# EAGLE design Display (EAGLE 4.14)
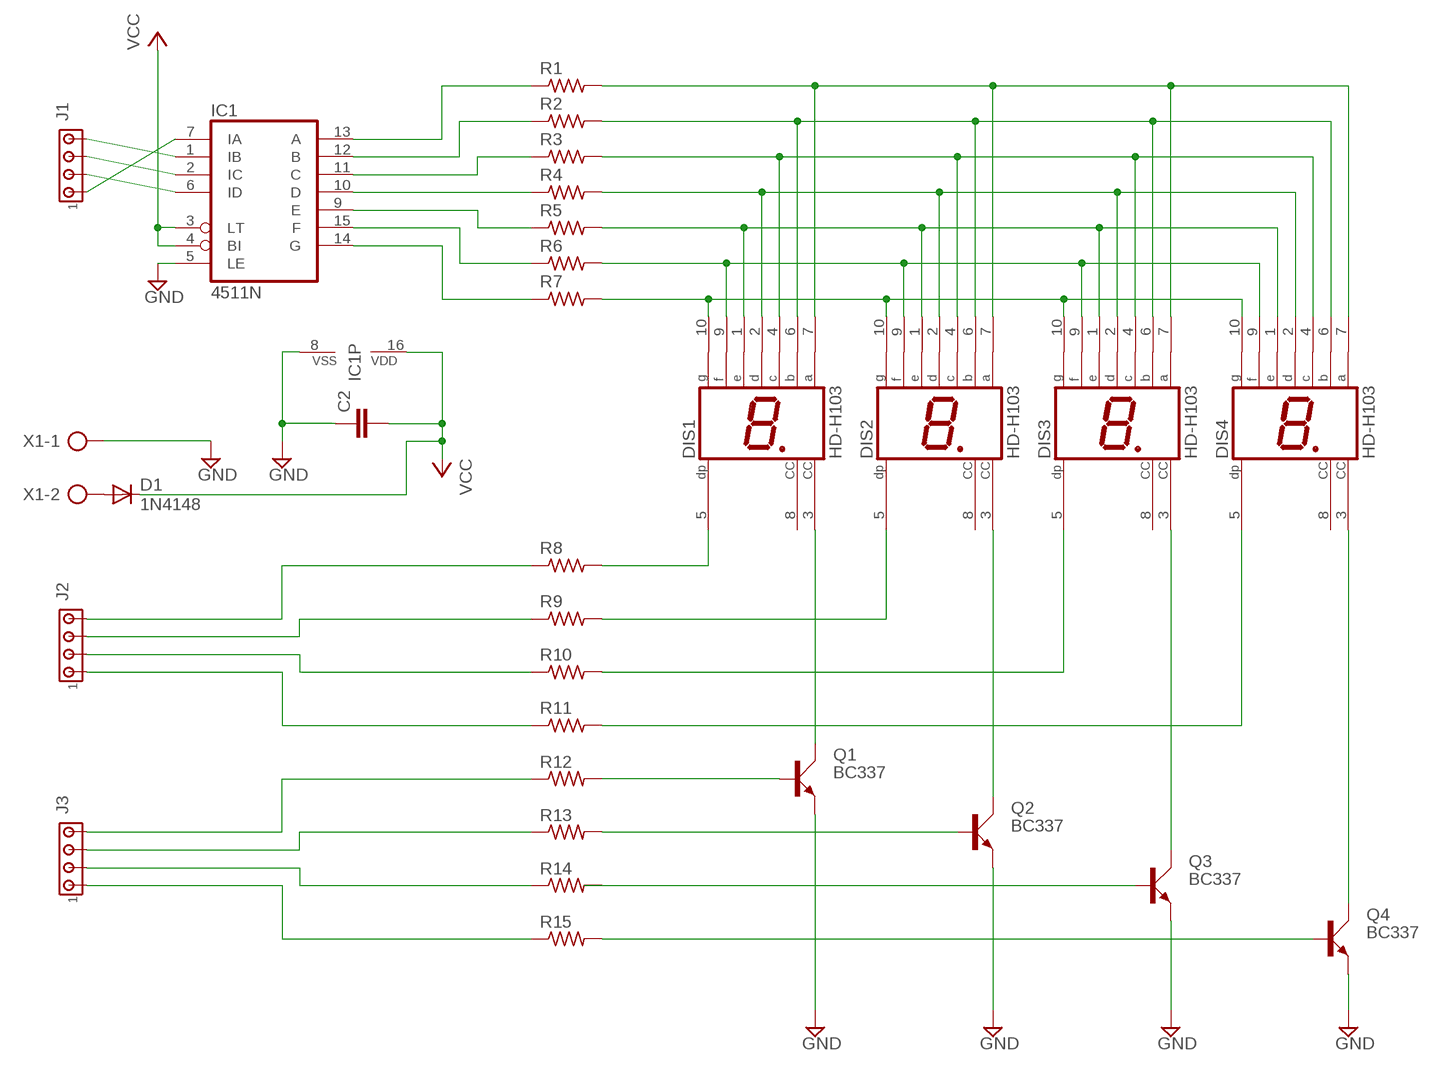
[diagram p0: schematic, sheet 1]

## Parts
C2  C5/3  [C5B3]
D1  1N4148  [DO35-10]
DIS1  HD-H103  [HDSP-M]
DIS2  HD-H103  [HDSP-M]
DIS3  HD-H103  [HDSP-M]
DIS4  HD-H103  [HDSP-M]
IC1  4511N  [DIL16]
J1  MTA04-100  [10X04MTA]
J2  MTA04-100  [10X04MTA]
J3  MTA04-100  [10X04MTA]
Q1  BC337  [SOT54A]
Q2  BC337  [SOT54A]
Q3  BC337  [SOT54A]
Q4  BC337  [SOT54A]
R1  R_0603  [R0603]
R2  R_0603  [R0603]
R3  R_0603  [R0603]
R4  R_0603  [R0603]
R5  R_0603  [R0603]
R6  R_0603  [R0603]
R7  R_0603  [R0603]
R8  R_0603  [R0603]
R9  R_0603  [R0603]
R10  R_0603  [R0603]
R11  R_0603  [R0603]
R12  R-US_0207/12  [0207/12]
R13  R-US_0207/12  [0207/12]
R14  R-US_0207/12  [0207/12]
R15  R-US_0207/12  [0207/12]
X1  AK500/2  [AK500/2]

## Nets
GND: C2.1 IC1.5(LE) IC1.8(VSS) Q1.E Q2.E Q3.E Q4.E X1.1
N$1: DIS1.10(G) DIS2.10(G) DIS3.10(G) DIS4.10(G) R7.2
N$2: DIS1.9(F) DIS2.9(F) DIS3.9(F) DIS4.9(F) R6.2
N$3: DIS1.1(E) DIS2.1(E) DIS3.1(E) DIS4.1(E) R5.2
N$4: DIS1.2(D) DIS2.2(D) DIS3.2(D) DIS4.2(D) R4.2
N$5: DIS1.4(C) DIS2.4(C) DIS3.4(C) DIS4.4(C) R3.2
N$6: DIS1.6(B) DIS2.6(B) DIS3.6(B) DIS4.6(B) R2.2
N$7: DIS1.7(A) DIS2.7(A) DIS3.7(A) DIS4.7(A) R1.2
N$8: IC1.13(A) R1.1
N$9: IC1.14(G) R7.1
N$10: IC1.15(F) R6.1
N$11: IC1.12(B) R2.1
N$12: IC1.11(C) R3.1
N$13: IC1.9(E) R5.1
N$14: IC1.10(D) R4.1
N$15: DIS1.5(DP) R8.2
N$16: DIS2.5(DP) R9.2
N$17: DIS3.5(DP) R10.2
N$18: DIS4.5(DP) R11.2
N$19: DIS1.3(CC) Q1.C
N$20: DIS2.3(CC) Q2.C
N$21: DIS3.3(CC) Q3.C
N$22: DIS4.3(CC) Q4.C
N$23: Q1.B R12.2
N$24: Q2.B R13.2
N$25: Q3.B R14.2
N$26: Q4.B R15.2
N$27: J2.1 R11.1
N$28: J2.4 R8.1
N$29: J2.3 R9.1
N$30: J2.2 R10.1
N$31: J3.4 R12.1
N$32: J3.3 R13.1
N$33: J3.1 R15.1
N$34: J3.2 R14.1
N$35: IC1.1(IB) J1.4
N$36: IC1.2(IC) J1.3
N$37: IC1.6(ID) J1.2
N$38: IC1.7(IA) J1.1
N$39: D1.A X1.2
VCC: C2.2 D1.C IC1.3(LT) IC1.4(BI) IC1.16(VDD)
Unconnected: DIS1.8(CC) DIS2.8(CC) DIS3.8(CC) DIS4.8(CC)

## Library data of the parts
C2 = capacitor-wima:C: CAPACITOR naming: grid - package width
D1 = diode:1N4148: DIODE high speed (Philips)
DIS1-DIS4 = display-hp:HD-H103: LED DISPLAY 1-character 7 segment, decimal point right
IC1 = 45xx:4511: BCD to 7-segment LATCH/DECODER/DRIVER
J1-J3 = con-amp:MTA04-100: AMP connector
Q1-Q4 = transistor-small-signal:BC337: NPN TRANSISTOR
R1-R11 = rc-master:R_: RESISTOR
R12-R15 = rcl:R-US_: RESISTOR, American symbol
X1 = con-ptr500:AK500/2: CONNECTOR

## Board
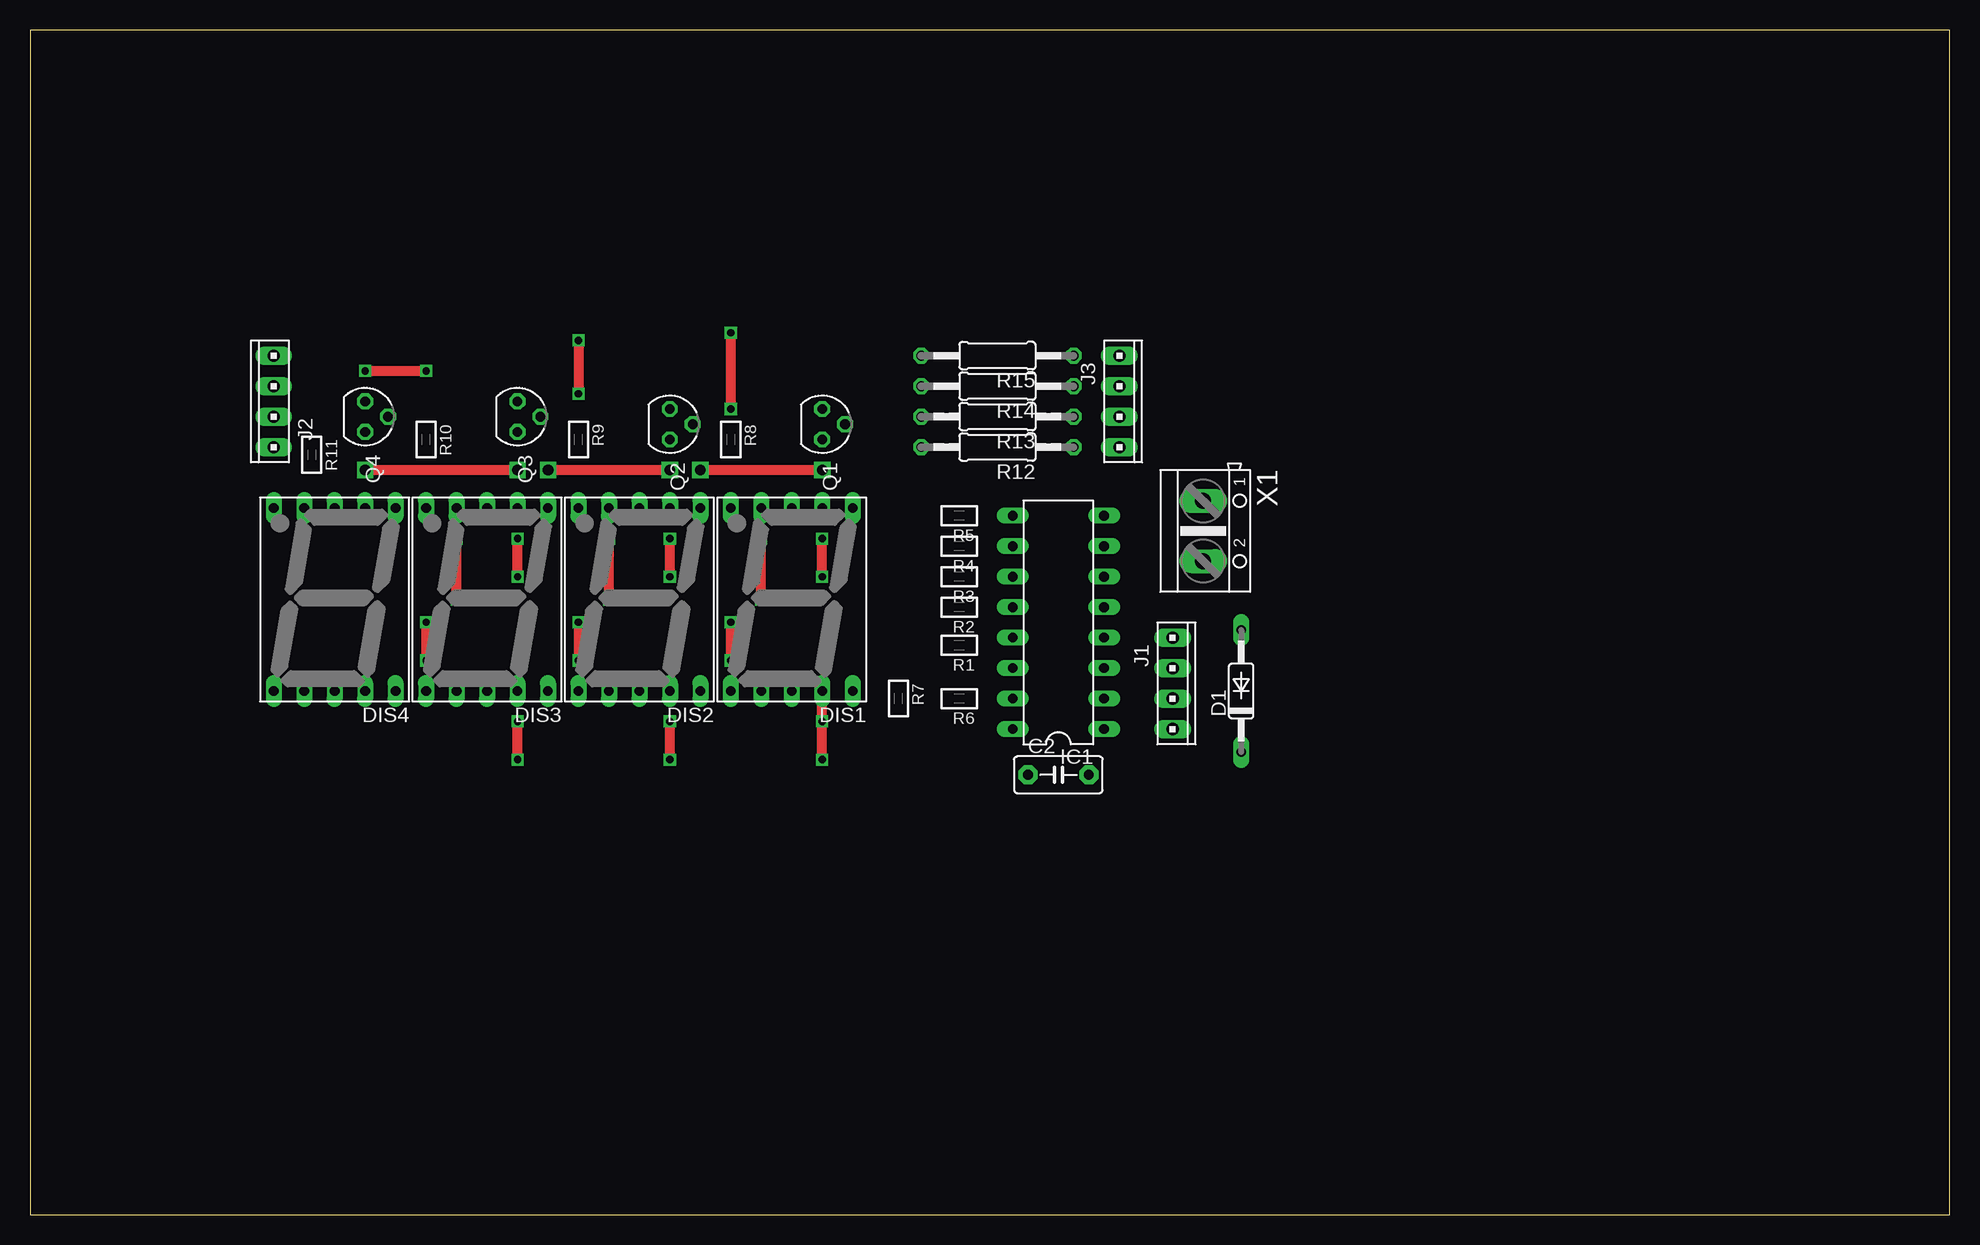
[diagram p1: board, top side]
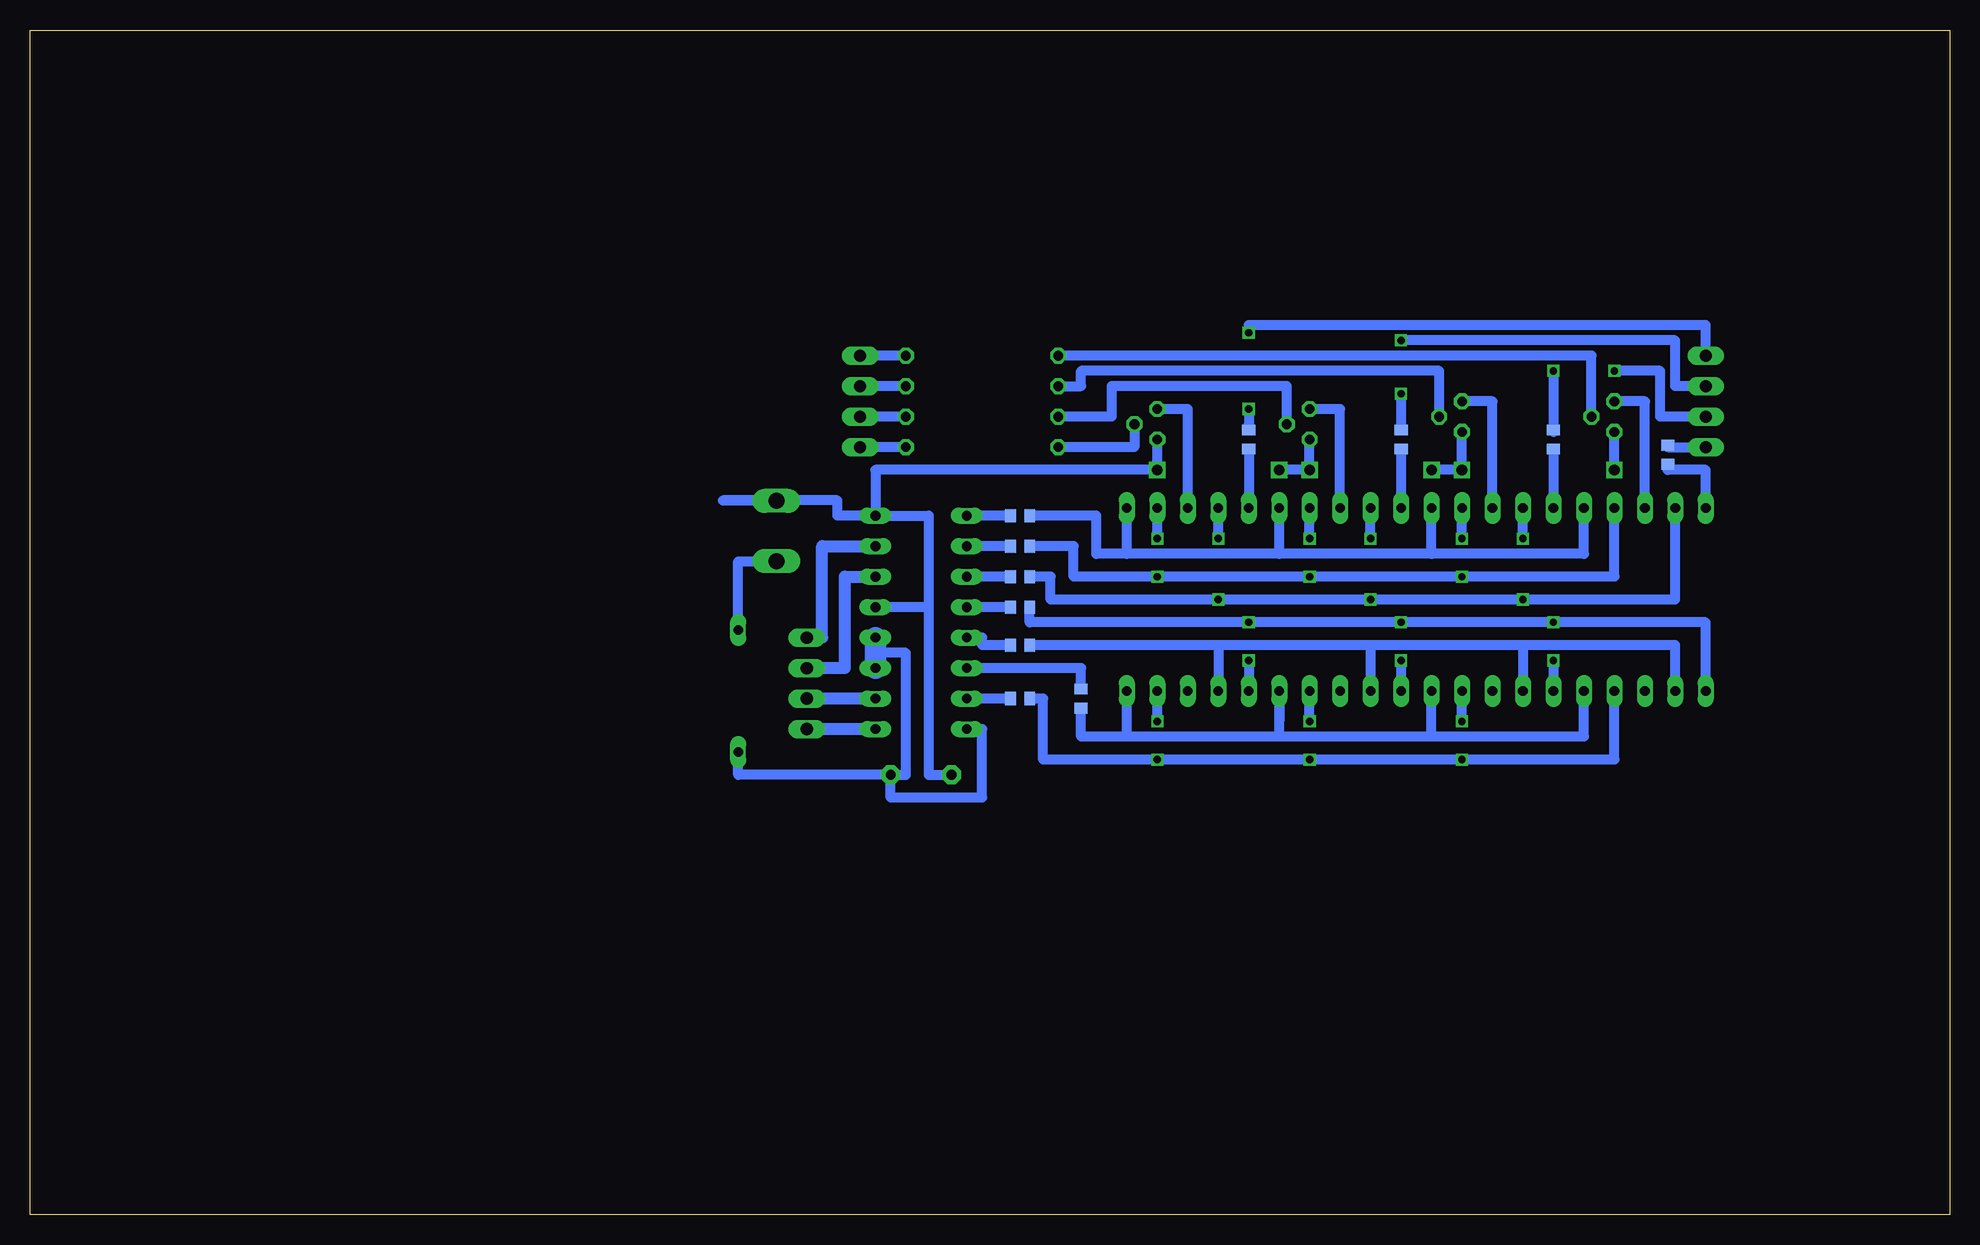
[diagram p2: board, bottom side, seen from below]

Size 160 x 98.73 mm. Coordinates in mm from the lower left corner, seen from the top.
Outline: 0,0 160,0 160,98.73 0,98.73 0,0
Copper layers (1*16): Top 0.035mm / dielectric 1.5mm / Bottom 0.035mm
Design rules "default": minimum track width 10mil, minimum drill 24mil, track to track 8mil, track to pad 8mil, pad to pad 8mil, via to via 8mil, smd to smd 8mil, copper to edge 40mil, drill to drill 8mil, minimum pad ring 10mil, minimum via ring 8mil, stop-mask expansion 4mil, vias tented up to drill 0mil, thermal gap 10mil

### Footprints (pad centres in the part's own frame; a part is rotated, then mirrored left to right if it is on the bottom)
C5B3 = drill 0.813 pad 1.6 octagon: 1 -2.54,0; 2 2.54,0
DO35-10 = drill 0.813 long: A 5.08,0; C -5.08,0
HDSP-M = drill 0.813 long: 1 -5.08,-7.62; 2 -2.54,-7.62; 3 0,-7.62; 4 2.54,-7.62; 5 5.08,-7.62; 6 5.08,7.62; 7 2.54,7.62; 8 0,7.62; 9 -2.54,7.62; 10 -5.08,7.62
DIL16 = drill 0.813 long: 1 -8.89,-3.81; 2 -6.35,-3.81; 3 -3.81,-3.81; 4 -1.27,-3.81; 5 1.27,-3.81; 6 3.81,-3.81; 7 6.35,-3.81; 8 8.89,-3.81; 9 8.89,3.81; 10 6.35,3.81; 11 3.81,3.81; 12 1.27,3.81; 13 -1.27,3.81; 14 -3.81,3.81; 15 -6.35,3.81; 16 -8.89,3.81
10X04MTA = drill 1.016 long: 1 -3.81,0; 2 -1.27,0; 3 1.27,0; 4 3.81,0
SOT54A = drill 0.813 octagon: B 0,1.905; C -1.27,0; E 1.27,0
R0603 = smd 0.9 x 1.1 bottom: 1 -0.794,0; 2 0.794,0
0207/12 = drill 0.813 octagon: 1 -6.35,0; 2 6.35,0
AK500/2 = drill 1.321 long: 1 -2.515,0; 2 2.515,0

### Placement (x,y rotation side)
C2  85.72,36.67 0 top
D1  100.96,43.65 90 top
DIS1  63.5,51.27 180 top
DIS2  50.8,51.27 180 top
DIS3  38.1,51.27 180 top
DIS4  25.39,51.27 180 top
IC1  85.72,49.37 90 top
J1  95.24,44.29 270 top
J2  20.31,67.78 90 top
J3  90.8,67.78 270 top
Q1  66.03,65.88 270 top
Q2  53.34,65.88 270 top
Q3  40.64,66.51 270 top
Q4  27.93,66.51 270 top
R1  77.46,47.46 180 top
R2  77.46,50.64 180 top
R3  77.46,53.18 180 top
R4  77.46,55.72 180 top
R5  77.46,58.26 180 top
R6  77.46,43.02 180 top
R7  72.38,43.02 270 top
R8  58.41,64.61 270 top
R9  45.72,64.61 270 top
R10  33.02,64.61 270 top
R11  23.49,63.34 270 top
R12  80.64,63.97 180 top
R13  80.64,66.51 180 top
R14  80.64,69.05 180 top
R15  80.64,71.59 180 top
X1  97.78,56.98 270 top

### Tracks (layer width: path | path; a pad name or v marks a point on that pad's centre or on a via)
GND  (via drill 0.9 pad 0.3)
  Top 0.813: v43.18,62.07 v53.34,62.07 | v55.88,62.07 v66.03,62.07 | v27.93,62.07 v40.64,62.07
  Bottom 0.813: Q3.E v40.64,62.07 v43.18,62.07 | Q2.E v53.34,62.07 v55.88,62.07 | Q1.E v66.03,62.07 89.53,62.07 IC1.8 | v27.93,62.07 Q4.E | IC1.8 92.7,58.26 92.7,59.53 102.23,59.53 X1.1 | 85.08,50.64 85.08,58.26 IC1.8 | 85.08,50.64 IC1.5 | 85.08,50.64 85.08,36.67 C2.1
N$1
  Bottom 0.813: 43.18,39.84 30.47,39.84 DIS4.10 | 43.18,39.84 55.88,39.84 | 55.88,39.84 68.57,39.84 | 68.57,39.84 DIS1.10 | 55.88,41.11 DIS2.10 55.88,39.84 | 43.18,39.84 DIS3.10 | 68.57,39.84 72.38,39.84 R7.2
N$2  (via drill 0.6)
  Top 0.813: v66.03,41.11 v66.03,37.94 DIS1.9 | v53.34,37.94 v53.34,41.11 | v40.64,37.94 v40.64,41.11
  Bottom 0.813: v53.34,41.11 DIS2.9 | DIS4.9 27.93,37.94 v40.64,37.94 v53.34,37.94 v66.03,37.94 75.56,37.94 75.56,43.02 R6.2 | v40.64,41.11 DIS3.9 | v66.03,41.11 DIS1.9 v66.03,41.11
N$3
  Bottom 0.813: 43.18,55.08 30.47,55.08 DIS4.1 | 43.18,55.08 55.88,55.08 | 55.88,55.08 68.57,55.08 | 68.57,55.08 DIS1.1 | 55.88,55.08 DIS2.1 | 43.18,55.08 DIS3.1 | 68.57,55.08 71.11,55.08 71.11,58.26 R5.2
N$4  (via drill 0.6)
  Top 0.813: v66.03,53.18 v66.03,56.35 | v53.34,53.18 v53.34,56.35 | v40.64,53.18 v40.64,56.35
  Bottom 0.813: DIS4.2 27.93,53.18 v40.64,53.18 v53.34,53.18 v66.03,53.18 73.02,53.18 73.02,55.72 R4.2 | v66.03,56.35 DIS1.2 | v53.34,56.35 DIS2.2 | v40.64,56.35 DIS3.2
N$5  (via drill 0.6)
  Top 0.813: v35.55,51.27 v35.55,56.35 | v48.26,51.27 v48.26,56.35 | v60.96,51.27 v60.96,56.35
  Bottom 0.813: DIS4.4 22.86,51.27 v35.55,51.27 v48.26,51.27 v60.96,51.27 74.92,51.27 74.92,53.18 R3.2 | v35.55,56.35 DIS3.4 | v48.26,56.35 DIS2.4 | v60.96,56.35 DIS1.4
N$6  (via drill 0.6)
  Top 0.813: v33.02,49.37 v33.02,46.19 | v45.72,49.37 v45.72,46.19 | v58.41,49.37 v58.41,46.19
  Bottom 0.813: DIS4.6 20.31,49.37 v33.02,49.37 v45.72,49.37 v58.41,49.37 76.67,49.37 R2.2 | v33.02,46.19 DIS3.6 | v45.72,46.19 DIS2.6 | v58.41,46.19 DIS1.6
N$7
  Bottom 0.813: 35.55,47.46 22.86,47.46 DIS4.7 | 35.55,47.46 48.26,47.46 | 48.26,47.46 60.96,47.46 | 60.96,47.46 R1.2 | 48.26,47.46 DIS2.7 | 35.55,47.46 DIS3.7 | 60.96,47.46 DIS1.7
N$8
  Bottom 0.813: R1.1 80.64,47.46 80.64,48.1 IC1.13
N$9
  Bottom 0.813: R7.1 72.38,45.55 IC1.14
N$10
  Bottom 0.813: R6.1 IC1.15
N$11
  Bottom 0.813: R2.1 IC1.12
N$12
  Bottom 0.813: R3.1 IC1.11
N$13
  Bottom 0.813: R5.1 IC1.9
N$14
  Bottom 0.813: R4.1 IC1.10
N$15
  Bottom 0.813: R8.2 DIS1.5
N$16
  Bottom 0.813: R9.2 DIS2.5
N$17
  Bottom 0.813: R10.2 DIS3.5
N$18
  Bottom 0.813: R11.2 23.49,62.07 20.31,62.07 DIS4.5
N$19
  Bottom 0.813: Q1.C 63.5,67.14 DIS1.3
N$20
  Bottom 0.813: Q2.C 50.8,67.14 DIS2.3
N$21
  Bottom 0.813: Q3.C 38.1,67.78 DIS3.3
N$22
  Bottom 0.813: Q4.C 25.39,67.78 DIS4.3
N$23
  Bottom 0.813: Q1.B 67.94,63.97 R12.2
N$24
  Bottom 0.813: R13.2 69.84,66.51 69.84,69.05 55.24,69.05 Q2.B
N$25
  Bottom 0.813: Q3.B 42.54,70.32 72.38,70.32 72.38,69.05 R14.2
N$26
  Bottom 0.813: Q4.B 29.84,71.59 R15.2
N$27
  Bottom 0.813: R11.1 23.49,63.97 J2.1
N$28  (via drill 0.6)
  Top 0.813: v58.41,73.5 v58.41,67.14
  Bottom 0.813: J2.4 20.31,74.13 58.41,74.13 v58.41,73.5 | 58.41,65.88 R8.1 v58.41,67.14
N$29  (via drill 0.6)
  Top 0.813: v45.72,72.86 v45.72,68.42
  Bottom 0.813: J2.3 22.86,69.05 22.86,72.86 v45.72,72.86 | v45.72,68.42 R9.1
N$30  (via drill 0.6)
  Top 0.813: v27.93,70.32 v33.02,70.32
  Bottom 0.813: J2.2 24.12,66.51 24.12,70.32 v27.93,70.32 | 33.02,65.24 R10.1 v33.02,70.32
N$31
  Bottom 0.813: R12.1 J3.4
N$32
  Bottom 0.813: R13.1 J3.3
N$33
  Bottom 0.813: R15.1 J3.1
N$34
  Bottom 0.813: R14.1 J3.2
N$35
  Bottom 1.016: IC1.1 J1.4
N$36
  Bottom 1.016: IC1.2 J1.3
N$37
  Bottom 1.016: J1.2 92.07,45.55 92.07,53.18 IC1.6
N$38
  Bottom 1.016: J1.1 93.97,48.1 93.97,55.72 IC1.7
N$39
  Bottom 0.813: X1.2 100.96,54.45 D1.A
VCC
  Bottom 0.813: C2.2 88.26,34.76 80.64,34.76 80.64,40.48 IC1.16 | C2.2 100.96,36.67 D1.C | C2.2 86.99,36.67 86.99,46.83 89.53,46.83
  Bottom 1.778: IC1.3 89.53,46.83 IC1.4